# Altium schematic sheet JTAG.SchDoc
size A; SheetNumber: 5; SheetTotal: 12
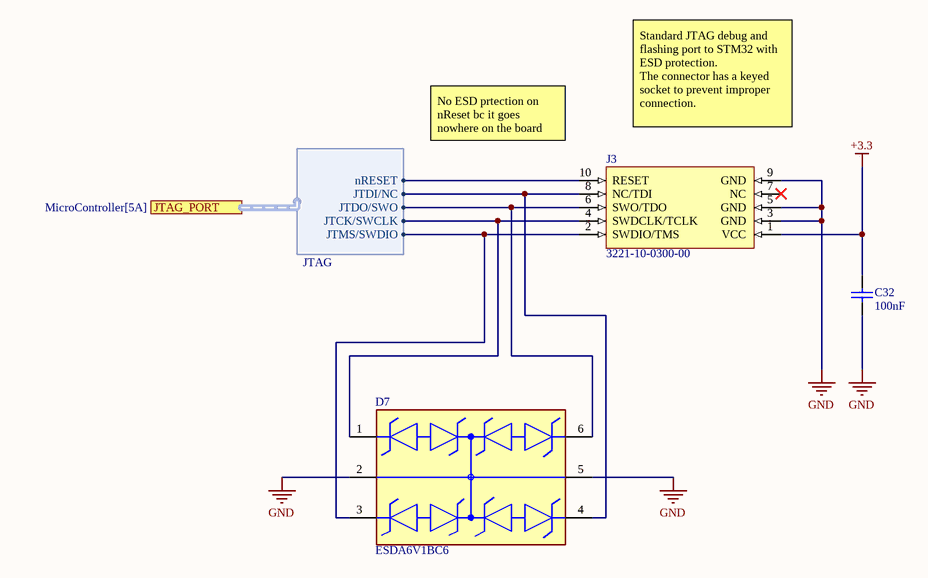
[diagram p0: JTAG.SchDoc]

## Parts
C32  value 100nF  [CAPC1608X90X40ML10T20]  (hidden comment: Capacitor 0.1uF +/-10% 50 V 0603)
D7  ESDA6V1BC6  [FP-SOT23-6L-IPC_A]
J3  3221-10-0300-00  [3221-10-0300-00-Footprint-1]

## Ports
JTAG_PORT (harness JTAG, see MicroController[5A])

## Harnesses
JTAG: JTMS/SWDIO, JTCK/SWCLK, JTDO/SWO, JTDI/NC, nRESET

## Nets
+3.3: C32.2 J3.1(VCC)
GND: C32.1 D7.2 D7.5 J3.3(GND) J3.5(GND) J3.9(GND)
NetD7_1: D7.1 J3.4(SWDCLK/TCLK) ; port JTAG_PORT.JTCK/SWCLK
NetD7_3: D7.3 J3.2(SWDIO/TMS) ; port JTAG_PORT.JTMS/SWDIO
NetD7_4: D7.4 J3.8(NC/TDI) ; port JTAG_PORT.JTDI/NC
NetD7_6: D7.6 J3.6(SWO/TDO) ; port JTAG_PORT.JTDO/SWO
NetJ3_10: J3.10(RESET) ; port JTAG_PORT.nRESET

Not connected (* = marked no-connect by the designer): J3 7(NC)*

## Notes on the sheet
- Standard JTAG debug and flashing port to STM32 with ESD protection.
  The connector has a keyed socket to prevent improper connection.
- No ESD prtection on nReset bc it goes nowhere on the board

## Library data of the parts
C32 = CMP-001-00017-10: Chip Capacitor, 0.1uF, +/- 10%, 50 V, 0603 (1608 Metric); Capacitor Type: Ceramic; Voltage Rating: 50V; Min Operating Temperature: -55°C; Max Operating Temperature: 125°C; Mounting Technology: SMT; Tolerance: 10%; Pins: 2; Case/Package: 0603
D7 = CMP-004-00048-1: Trans Voltage Suppressor Diode, 80W, 5V V(RWM), Bidirectional, 4 Element, Silicon; Max Surge Current: 8A; Peak Inverse Voltage: 8V; Max Operating Temperature: 150°C; Pins: 6; Mounting Technology: SMD; RoHS Compliant: Yes; Case/Package: SOT23-6L
J3 = CMP-002-00077-1: JTAG STLINK CONN HEADER SMD 10POS 1.27MM